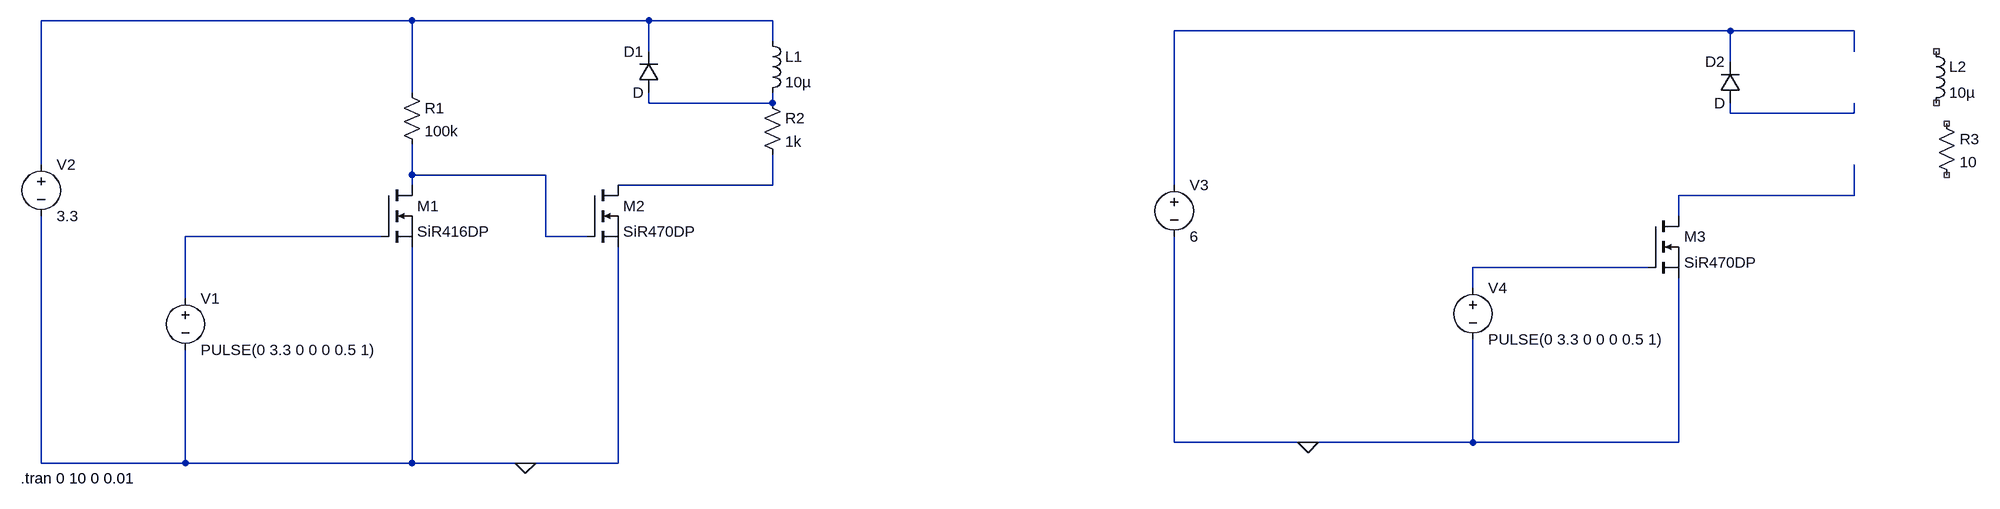
[diagram p0: schematic electromagnet.asc]
electromagnet.asc, the LTspice schematic file:
Version 4
SHEET 1 2948 680
WIRE 144 -128 -432 -128
WIRE 512 -128 144 -128
WIRE 704 -128 512 -128
WIRE 2192 -112 1328 -112
WIRE 2384 -112 2192 -112
WIRE 704 -96 704 -128
WIRE 512 -80 512 -128
WIRE 2384 -80 2384 -112
WIRE 2192 -64 2192 -112
WIRE 144 -16 144 -128
WIRE 512 0 512 -16
WIRE 704 0 704 -16
WIRE 704 0 512 0
WIRE 2192 16 2192 0
WIRE 2384 16 2384 0
WIRE 2384 16 2192 16
WIRE -432 96 -432 -128
WIRE 144 112 144 64
WIRE 352 112 144 112
WIRE 144 128 144 112
WIRE 704 128 704 80
WIRE 704 128 464 128
WIRE 1328 128 1328 -112
WIRE 2384 144 2384 96
WIRE 2384 144 2112 144
WIRE 2112 176 2112 144
WIRE 96 208 -208 208
WIRE 352 208 352 112
WIRE 416 208 352 208
WIRE 2064 256 1792 256
WIRE 1792 288 1792 256
WIRE -208 304 -208 208
WIRE 1328 528 1328 208
WIRE 1536 528 1328 528
WIRE 1792 528 1792 368
WIRE 1792 528 1536 528
WIRE 2112 528 2112 272
WIRE 2112 528 1792 528
WIRE -432 560 -432 176
WIRE -208 560 -208 384
WIRE -208 560 -432 560
WIRE 144 560 144 224
WIRE 144 560 -208 560
WIRE 320 560 144 560
WIRE 464 560 464 224
WIRE 464 560 320 560
FLAG 320 560 0
FLAG 1536 528 0
SYMBOL nmos 96 128 R0
SYMATTR InstName M1
SYMATTR Value SiR416DP
SYMBOL nmos 416 128 R0
SYMATTR InstName M2
SYMATTR Value SiR470DP
SYMBOL res 128 -32 R0
SYMATTR InstName R1
SYMATTR Value 100k
SYMBOL voltage -208 288 R0
WINDOW 123 0 0 Left 0
WINDOW 39 0 0 Left 0
SYMATTR InstName V1
SYMATTR Value PULSE(0 3.3 0 0 0 0.5 1)
SYMBOL voltage -432 80 R0
WINDOW 123 0 0 Left 0
WINDOW 39 0 0 Left 0
SYMATTR InstName V2
SYMATTR Value 3.3
SYMBOL diode 528 -16 R180
WINDOW 0 24 64 Left 2
WINDOW 3 24 0 Left 2
SYMATTR InstName D1
SYMBOL ind 688 -112 R0
SYMATTR InstName L1
SYMATTR Value 10µ
SYMBOL res 688 -16 R0
SYMATTR InstName R2
SYMATTR Value 1k
SYMBOL voltage 1328 112 R0
WINDOW 123 0 0 Left 0
WINDOW 39 0 0 Left 0
SYMATTR InstName V3
SYMATTR Value 6
SYMBOL voltage 1792 272 R0
WINDOW 123 0 0 Left 0
WINDOW 39 0 0 Left 0
SYMATTR InstName V4
SYMATTR Value PULSE(0 3.3 0 0 0 0.5 1)
SYMBOL nmos 2064 176 R0
SYMATTR InstName M3
SYMATTR Value SiR470DP
SYMBOL diode 2208 0 R180
WINDOW 0 24 64 Left 2
WINDOW 3 24 0 Left 2
SYMATTR InstName D2
SYMBOL ind 2496 -96 R0
SYMATTR InstName L2
SYMATTR Value 10µ
SYMBOL res 2512 16 R0
SYMATTR InstName R3
SYMATTR Value 10
TEXT -464 584 Left 2 !.tran 0 10 0 0.01

The netlist it stands for:
* electromagnet.asc
M1 N005 N008 0 0 SiR416DP
M2 N006 N005 0 0 SiR470DP
R1 N001 N005 100k
V1 N008 0 PULSE(0 3.3 0 0 0 0.5 1)
V2 N001 0 3.3
D1 N003 N001 D
L1 N001 N003 10µ
R2 N003 N006 1k
V3 N002 0 6
V4 N009 0 PULSE(0 3.3 0 0 0 0.5 1)
M3 N007 N009 0 0 SiR470DP
D2 N004 N002 D
L2 NC_01 NC_02 10µ
R3 NC_03 NC_04 10
.model D D
.lib standard.dio
.model NMOS NMOS
.model PMOS PMOS
.lib standard.mos
.tran 0 10 0 0.01
.backanno
.end